# Altium project DecodingTool.PrjPcb
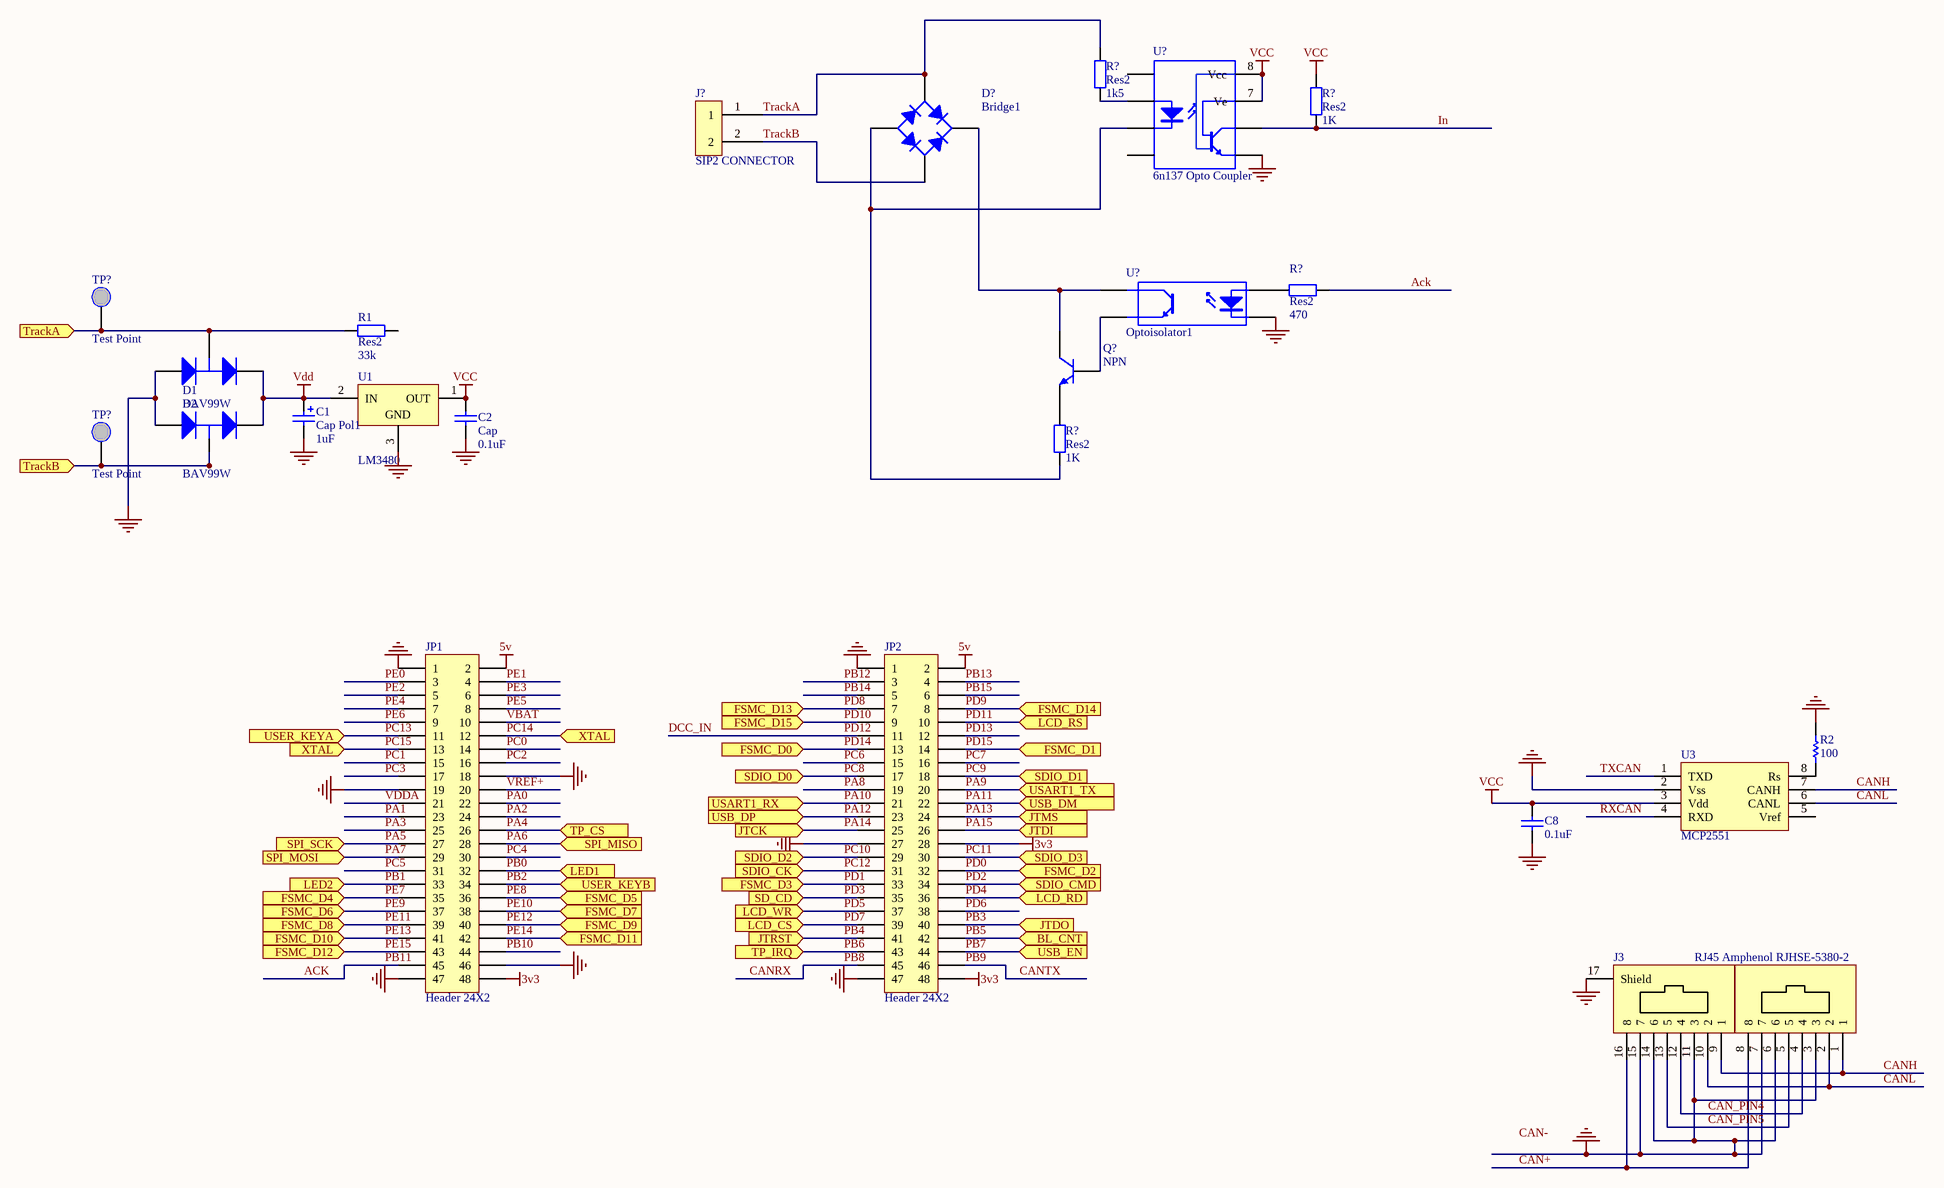
[diagram p0: DecodingTool.SchDoc]
1 sheet, 23 parts. Net scope: flat (ports and power ports of the same name join across sheets).

## Sheet DecodingTool.SchDoc
size A0

### Parts
(Parts that share a designator on the sheet are numbered #1, #2 ... from top to bottom, then left to right.)
C1  Cap Pol1  value 1uF  [CC3216-1206]
C2  Cap  value 0.1uF  [CC2012-0805]
C8  value 0.1uF  [Cap SMD 0805A]  (hidden comment: Cap)
D1  BAV99W  [SOT-323]
D2  BAV99W  [SOT-323]
D?  Bridge1  [E-BIP-P4/D10]
J3  RJ45 Amphenol RJHSE-5380-2  [Amphenol RJHSE-5380-2]
J?  SIP2 CONNECTOR  [0.1 SIP 2 PIN]
JP1  Header 24X2  [HDR2X24]
JP2  Header 24X2  [HDR2X24]
Q?  NPN  [BCY-W3]
R1  Res2  value 33k  [CC2012-0805]
R2  value 100  [Res SMD 0805A]  (hidden comment: Res1)
R?#1  Res2  value 1k5  [AXIAL-0.4]
R?#2  Res2  value 1K  [AXIAL-0.4]
R?#3  Res2  value 470  [AXIAL-0.4]
R?#4  Res2  value 1K  [AXIAL-0.4]
TP?#1  Test Point  [TestPoint]
TP?#2  Test Point  [TestPoint]
U1  LM3480  [SO-G3]
U3  MCP2551  [SOIC8]
U?#1  6n137 Opto Coupler  [8P3]
U?#2  Optoisolator1  [DIP-4]

### Ports
BL_CNT (in), FSMC_D0 (in), FSMC_D1 (in), FSMC_D2 (in), FSMC_D3 (in), FSMC_D4 (in), FSMC_D5 (in), FSMC_D6 (in), FSMC_D7 (in), FSMC_D8 (in), FSMC_D9 (in), FSMC_D10 (in), FSMC_D11 (in), FSMC_D12 (in), FSMC_D13 (in), FSMC_D14 (in), FSMC_D15 (in), JTCK (in), JTDI (in), JTDO (in), JTMS (in), JTRST (in), LCD_CS (in), LCD_RD (in), LCD_RS (in), LCD_WR (in), LED1 (in), LED2 (in), SD_CD (in), SDIO_CK (in), SDIO_CMD (in), SDIO_D0 (in), SDIO_D1 (in), SDIO_D2 (in), SDIO_D3 (in), SPI_MISO (in), SPI_MOSI (in), SPI_SCK (in), TP_CS (in), TP_IRQ (in), TrackA (in), TrackB (in), USART1_RX (in), USART1_TX (in), USB_DM (in), USB_DP (in), USB_EN (in), USER_KEYA (in), USER_KEYB (in), XTAL (in)

### Nets
3v3: JP1.48 JP2.28 JP2.48
5v: JP1.2 JP2.2
GND: C1.2 C2.1 C8.2 D1.1(A) D2.1(A) J3.3 J3.6 J3.7 J3.11(3) J3.14(6) J3.15(7) J3.17(Shield) JP1.1 JP1.18 JP1.19 JP1.46 JP1.47 JP2.1 JP2.27 JP2.47 R2.1 U1.3(GND) U3.2(Vss) U?#1.5(GND) U?#2.2(K)
VCC: C2.2 C8.1 R?#2.2 U1.1(OUT) U3.3(Vdd) U?#1.7(Ve) U?#1.8(Vcc)
Vdd: C1.1 D1.2(K) D2.2(K) U1.2(IN)
Ack: JP1.45 R?#3.2  [also labelled PB11]
CAN+: J3.8 J3.16(8)
CAN_PIN4: J3.4 J3.12(4)
CAN_PIN5: J3.5 J3.13(5)
CANH: J3.1 J3.9(1) U3.7(CANH)
CANL: J3.2 J3.10(2) U3.6(CANL)
CANRX: JP2.45  [also labelled PB8]
CANTX: JP2.46  [also labelled PB9]
DCC_IN: JP2.11  [also labelled PD12]
In: R?#2.1 U?#1.6(Vo)
PA0: JP1.22
PA1: JP1.23
PA2: JP1.24
PA3: JP1.25
PA4: JP1.26 ; port TP_CS
PA5: JP1.27 ; port SPI_SCK
PA6: JP1.28 ; port SPI_MISO
PA7: JP1.29 ; port SPI_MOSI
PA8: JP2.19
PA9: JP2.20 ; port USART1_TX
PA10: JP2.21 ; port USART1_RX
PA11: JP2.22 ; port USB_DM
PA12: JP2.23 ; port USB_DP
PA13: JP2.24 ; port JTMS
PA14: JP2.25 ; port JTCK
PA15: JP2.26 ; port JTDI
PB0: JP1.32 ; port LED1
PB1: JP1.33 ; port LED2
PB2: JP1.34 ; port USER_KEYB
PB3: JP2.40 ; port JTDO
PB4: JP2.41 ; port JTRST
PB5: JP2.42 ; port BL_CNT
PB6: JP2.43 ; port TP_IRQ
PB7: JP2.44 ; port USB_EN
PB10: JP1.44
PB12: JP2.3
PB13: JP2.4
PB14: JP2.5
PB15: JP2.6
PC0: JP1.14
PC1: JP1.15
PC2: JP1.16
PC3: JP1.17
PC4: JP1.30
PC5: JP1.31
PC6: JP2.15
PC7: JP2.16
PC8: JP2.17 ; port SDIO_D0
PC9: JP2.18 ; port SDIO_D1
PC10: JP2.29 ; port SDIO_D2
PC11: JP2.30 ; port SDIO_D3
PC12: JP2.31 ; port SDIO_CK
PC13: JP1.11 ; port USER_KEYA
PC14: JP1.12 JP1.13 ; port XTAL  [also labelled PC15]
PD0: JP2.32 ; port FSMC_D2
PD1: JP2.33 ; port FSMC_D3
PD2: JP2.34 ; port SDIO_CMD
PD3: JP2.35 ; port SD_CD
PD4: JP2.36 ; port LCD_RD
PD5: JP2.37 ; port LCD_WR
PD6: JP2.38
PD7: JP2.39 ; port LCD_CS
PD8: JP2.7 ; port FSMC_D13
PD9: JP2.8 ; port FSMC_D14
PD10: JP2.9 ; port FSMC_D15
PD11: JP2.10 ; port LCD_RS
PD13: JP2.12
PD14: JP2.13 ; port FSMC_D0
PD15: JP2.14 ; port FSMC_D1
PE0: JP1.3
PE1: JP1.4
PE2: JP1.5
PE3: JP1.6
PE4: JP1.7
PE5: JP1.8
PE6: JP1.9
PE7: JP1.35 ; port FSMC_D4
PE8: JP1.36 ; port FSMC_D5
PE9: JP1.37 ; port FSMC_D6
PE10: JP1.38 ; port FSMC_D7
PE11: JP1.39 ; port FSMC_D8
PE12: JP1.40 ; port FSMC_D9
PE13: JP1.41 ; port FSMC_D10
PE14: JP1.42 ; port FSMC_D11
PE15: JP1.43 ; port FSMC_D12
RXCAN: U3.4(RXD)
TrackA: D?.2(C) J?.1 R?#1.2
TrackB: D?.4(C) J?.2
TXCAN: U3.1(TXD)
VBAT: JP1.10
VDDA: JP1.21
VREF+: JP1.20
NetD1_3: D1.3(C) R1.1 TP?#1.1 ; port TrackA
NetD2_3: D2.3(C) TP?#2.1 ; port TrackB
NetD?_1: D?.1(A) R?#4.2 U?#1.3(K)
NetD?_3: D?.3(K) Q?.1(C) U?#2.3(C)
NetQ?_2: Q?.2(B) U?#2.4(E)
NetQ?_3: Q?.3(E) R?#4.1
NetR2_2: R2.2 U3.8(Rs)
NetR?#1_1: R?#1.1 U?#1.2(A)
NetR?#3_1: R?#3.1 U?#2.1(A)

Not connected (* = marked no-connect by the designer): R1 2; U3 5(Vref); U?#1 1(NC) 4(NC)

### Notes on the sheet
- Labels drawn without touching a wire or pin: CAN-

### Library data of the parts
C1 = Cap Pol1: Polarized Capacitor (Radial); Published: 8-Jun-2000; Revision: July-2002: Re-released for DXP Platform.; Publisher: Altium Limited
C2 C8 = Cap: Capacitor; Published: 8-Jun-2000; Publisher: Altium Limited
  C2: Revision: July-2002: Re-released for DXP Platform.
  C8: LatestRevisionDate: 17-Jul-2002; LatestRevisionNote: Re-released for DXP Platform.; PackageReference: RAD-0.3; PackageDescription: Radial Cap, Thru-Hole; 2 Leads; 0.3 in Pin Spacing
D1 D2 = BAV99W: Silicon Switching Diode Array for High-Speed Switching; Package Information: Latest Revision: Sep-2001; Published: 21-Mar-2003; Datasheet: Latest Revision: Oct-1999; Package Reference: SOT-323; Publisher: Altium Limited
D? = Bridge1: Full Wave Diode Bridge; Published: 8-Jun-2000; Revision: July-2002: Re-released for DXP Platform.; Publisher: Altium Limited
J3 = RJ45-2
JP1 JP2 = Header 24X2: Header, 24-Pin, Dual row; LatestRevisionDate: 17-Jul-2002; LatestRevisionNote: Re-released for DXP Platform.; Publisher: Altium Limited
Q? = NPN: NPN Bipolar Transistor; Code - JEDEC: TO-226-AA; Published: 8-Jun-2000; Revision: July-2002: Re-released for DXP Platform.; Publisher: Altium Limited
R1 R?#1-R?#4 = Res2: Resistor; Published: 8-Jun-2000; Revision: July-2002: Re-released for DXP Platform.; Publisher: Altium Limited
R2 = Resistor
TP?#1 TP?#2 = TestPoint
U1 = LM7805CT: Series 3-Terminal Positive Regulator; Package Information: Latest Revision: 1995; Note: Tab is connected to GND; Published: 15-Apr-2002; Datasheet: Latest Revision: May-1999; Package Reference: T03B; Publisher: Altium Limited
U3 = MCP2551: MCP2551 High Speed CAN Transceiver
U?#1 = 6n137
U?#2 = Optoisolator1: Optoisolator; Published: 24-Mar-1999; Revision: July-2002: Re-released for DXP Platform.; Publisher: Altium Limited